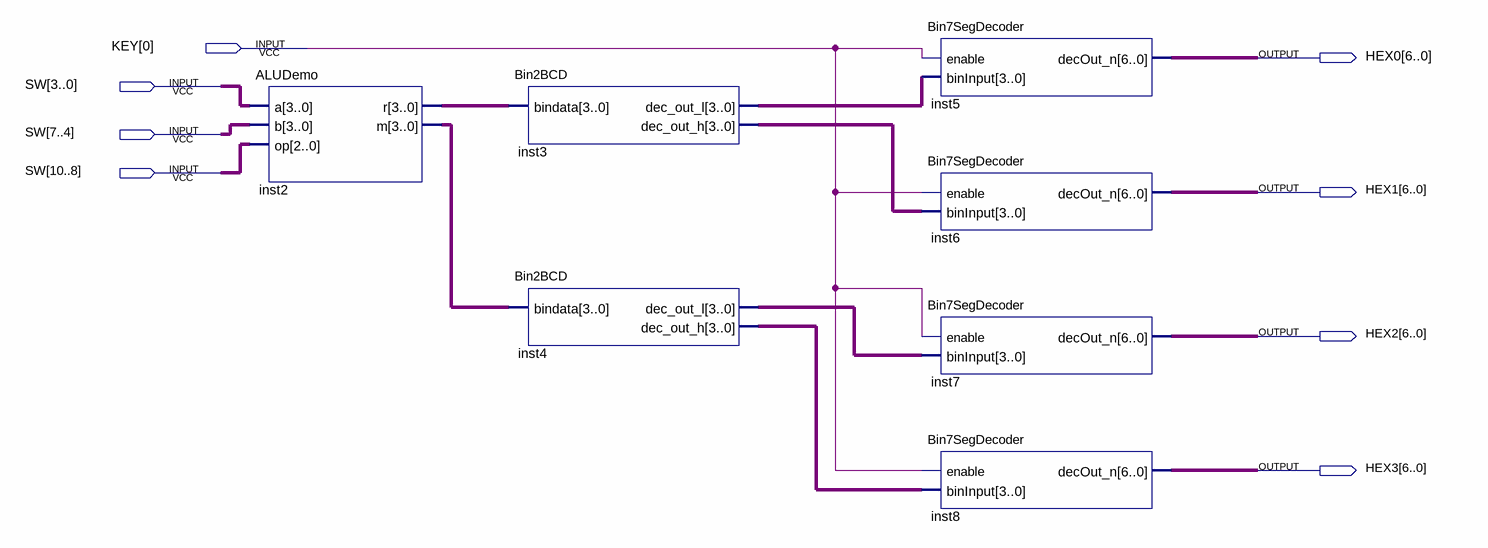
[diagram p0: schematic sheet]
// Quartus schematic ALUGate.bdf as structural Verilog: 7 symbols, 8 pins
module ALUGate (
  input  [0:0] KEY,
  input  [10:0] SW,
  output [6:0] HEX0,
  output [6:0] HEX1,
  output [6:0] HEX2,
  output [6:0] HEX3
);

  wire [3:0] inst2_m, inst2_r, inst3_dec_out_h, inst3_dec_out_l, inst4_dec_out_h, inst4_dec_out_l;

  ALUDemo inst2 (.a(SW[3:0]), .b(SW[7:4]), .op(SW[10:8]), .r(inst2_r), .m(inst2_m));
  Bin2BCD inst3 (.bindata(inst2_r), .dec_out_l(inst3_dec_out_l), .dec_out_h(inst3_dec_out_h));
  Bin2BCD inst4 (.bindata(inst2_m), .dec_out_l(inst4_dec_out_l), .dec_out_h(inst4_dec_out_h));
  Bin7SegDecoder inst5 (.enable(KEY[0]), .binInput(inst3_dec_out_l), .decOut_n(HEX0));
  Bin7SegDecoder inst6 (.enable(KEY[0]), .binInput(inst3_dec_out_h), .decOut_n(HEX1));
  Bin7SegDecoder inst7 (.enable(KEY[0]), .binInput(inst4_dec_out_l), .decOut_n(HEX2));
  Bin7SegDecoder inst8 (.enable(KEY[0]), .binInput(inst4_dec_out_h), .decOut_n(HEX3));
endmodule
